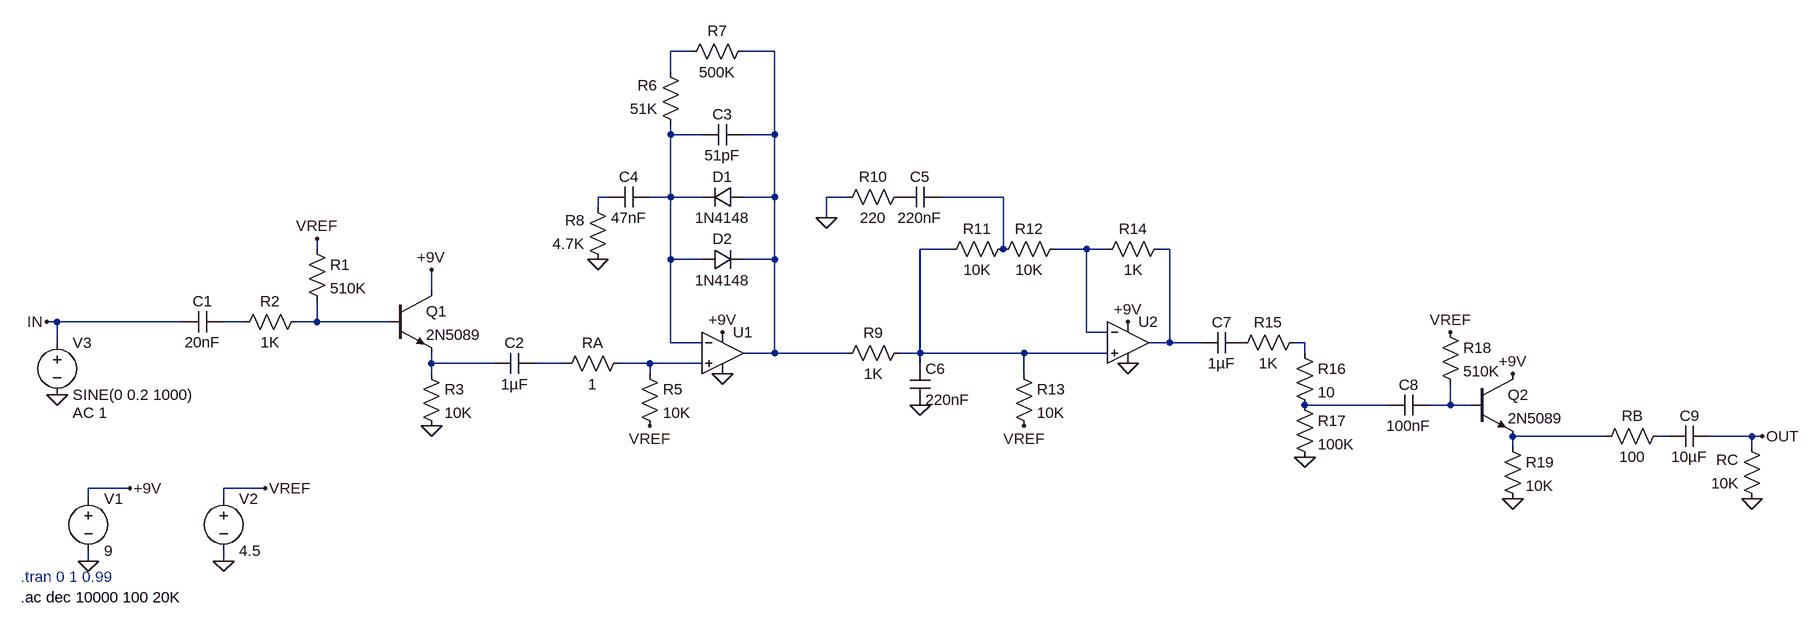
[diagram p0: schematic tubescreamer_sim.asc]
tubescreamer_sim.asc, the LTspice schematic file:
Version 4
SHEET 1 2276 680
WIRE 560 -272 528 -272
WIRE 688 -272 640 -272
WIRE 528 -240 528 -272
WIRE 528 -144 528 -160
WIRE 576 -144 528 -144
WIRE 688 -144 688 -272
WIRE 688 -144 640 -144
WIRE 432 -48 416 -48
WIRE 528 -48 528 -144
WIRE 528 -48 496 -48
WIRE 576 -48 528 -48
WIRE 688 -48 688 -144
WIRE 688 -48 640 -48
WIRE 800 -48 768 -48
WIRE 1040 -48 944 -48
WIRE 416 -32 416 -48
WIRE 768 -16 768 -48
WIRE -16 32 -16 16
WIRE 960 32 912 32
WIRE 1040 32 1040 -48
WIRE 1168 32 1120 32
WIRE 1200 32 1168 32
WIRE 1296 32 1280 32
WIRE 528 48 528 -48
WIRE 576 48 528 48
WIRE 688 48 688 -48
WIRE 688 48 640 48
WIRE 160 96 160 64
WIRE -416 144 -432 144
WIRE -224 144 -416 144
WIRE -128 144 -160 144
WIRE -16 144 -16 112
WIRE -16 144 -48 144
WIRE 96 144 -16 144
WIRE 1168 160 1168 32
WIRE 1200 160 1168 160
WIRE -416 176 -416 144
WIRE 528 176 528 48
WIRE 576 176 528 176
WIRE 1296 176 1296 32
WIRE 1296 176 1264 176
WIRE 1344 176 1296 176
WIRE 1504 176 1488 176
WIRE 688 192 688 48
WIRE 688 192 640 192
WIRE 800 192 688 192
WIRE 912 192 912 32
WIRE 912 192 880 192
WIRE 1072 192 912 192
WIRE 1200 192 1072 192
WIRE 1504 192 1504 176
WIRE 160 208 160 192
WIRE 256 208 160 208
WIRE 368 208 320 208
WIRE 496 208 448 208
WIRE 576 208 496 208
WIRE 912 208 912 192
WIRE 160 224 160 208
WIRE 496 224 496 208
WIRE 1072 224 1072 192
WIRE 1632 272 1504 272
WIRE 1728 272 1728 240
WIRE 1728 272 1696 272
WIRE 1760 272 1728 272
WIRE 1968 320 1824 320
WIRE 2064 320 2048 320
WIRE 2192 320 2128 320
WIRE 2208 320 2192 320
WIRE 1824 336 1824 320
WIRE 2192 336 2192 320
WIRE -304 400 -368 400
WIRE -96 400 -160 400
WIRE -368 416 -368 400
WIRE -160 416 -160 400
WIRE -368 512 -368 496
WIRE -160 512 -160 496
FLAG 160 304 0
FLAG -368 512 0
FLAG -304 400 +9V
FLAG -160 512 0
FLAG -96 400 VREF
FLAG 160 64 +9V
FLAG -16 16 VREF
FLAG 496 304 VREF
FLAG -416 256 0
FLAG -432 144 IN
FLAG 416 48 0
FLAG 608 160 +9V
FLAG 608 224 0
FLAG 768 -16 0
FLAG 912 272 0
FLAG 1072 304 VREF
FLAG 1232 144 +9V
FLAG 1232 208 0
FLAG 1504 352 0
FLAG 1728 160 VREF
FLAG 1824 416 0
FLAG 1824 224 +9V
FLAG 2192 416 0
FLAG 2208 320 OUT
SYMBOL npn 96 96 R0
SYMATTR InstName Q1
SYMATTR Value 2N5089
SYMBOL res -32 16 R0
SYMATTR InstName R1
SYMATTR Value 510K
SYMBOL res -32 128 R90
WINDOW 0 0 56 VBottom 2
WINDOW 3 32 56 VTop 2
SYMATTR InstName R2
SYMATTR Value 1K
SYMBOL res 144 208 R0
SYMATTR InstName R3
SYMATTR Value 10K
SYMBOL res 464 192 R90
WINDOW 0 0 56 VBottom 2
WINDOW 3 32 56 VTop 2
SYMATTR InstName RA
SYMATTR Value 1
SYMBOL res 480 208 R0
SYMATTR InstName R5
SYMATTR Value 10K
SYMBOL cap -160 128 R90
WINDOW 0 0 32 VBottom 2
WINDOW 3 32 32 VTop 2
SYMATTR InstName C1
SYMATTR Value 20nF
SYMBOL cap 320 192 R90
WINDOW 0 0 32 VBottom 2
WINDOW 3 32 32 VTop 2
SYMATTR InstName C2
SYMATTR Value 1µF
SYMBOL voltage -368 400 R0
WINDOW 123 0 0 Left 0
WINDOW 39 0 0 Left 0
SYMATTR InstName V1
SYMATTR Value 9
SYMBOL voltage -160 400 R0
WINDOW 123 0 0 Left 0
WINDOW 39 0 0 Left 0
SYMATTR InstName V2
SYMATTR Value 4.5
SYMBOL voltage -416 160 R0
WINDOW 123 24 124 Left 2
WINDOW 39 0 0 Left 0
SYMATTR Value2 AC 1
SYMATTR InstName V3
SYMATTR Value SINE(0 0.2 1000)
SYMBOL diode 640 -64 R90
WINDOW 0 0 32 VBottom 2
WINDOW 3 32 32 VTop 2
SYMATTR InstName D1
SYMATTR Value 1N4148
SYMBOL diode 576 64 R270
WINDOW 0 32 32 VTop 2
WINDOW 3 0 32 VBottom 2
SYMATTR InstName D2
SYMATTR Value 1N4148
SYMBOL cap 640 -160 R90
WINDOW 0 0 32 VBottom 2
WINDOW 3 32 32 VTop 2
SYMATTR InstName C3
SYMATTR Value 51pF
SYMBOL res 544 -144 R180
WINDOW 0 36 76 Left 2
WINDOW 3 36 40 Left 2
SYMATTR InstName R6
SYMATTR Value 51K
SYMBOL res 656 -288 R90
WINDOW 0 0 56 VBottom 2
WINDOW 3 32 56 VTop 2
SYMATTR InstName R7
SYMATTR Value 500K
SYMBOL cap 496 -64 R90
WINDOW 0 0 32 VBottom 2
WINDOW 3 32 32 VTop 2
SYMATTR InstName C4
SYMATTR Value 47nF
SYMBOL res 432 64 R180
WINDOW 0 36 76 Left 2
WINDOW 3 36 40 Left 2
SYMATTR InstName R8
SYMATTR Value 4.7K
SYMBOL res 896 176 R90
WINDOW 0 0 56 VBottom 2
WINDOW 3 32 56 VTop 2
SYMATTR InstName R9
SYMATTR Value 1K
SYMBOL res 896 -64 R90
WINDOW 0 0 56 VBottom 2
WINDOW 3 32 56 VTop 2
SYMATTR InstName R10
SYMATTR Value 220
SYMBOL cap 944 -64 R90
WINDOW 0 0 32 VBottom 2
WINDOW 3 32 32 VTop 2
SYMATTR InstName C5
SYMATTR Value 220nF
SYMBOL res 1056 16 R90
WINDOW 0 0 56 VBottom 2
WINDOW 3 32 56 VTop 2
SYMATTR InstName R11
SYMATTR Value 10K
SYMBOL res 1136 16 R90
WINDOW 0 0 56 VBottom 2
WINDOW 3 32 56 VTop 2
SYMATTR InstName R12
SYMATTR Value 10K
SYMBOL cap 896 208 R0
SYMATTR InstName C6
SYMATTR Value 220nF
SYMBOL res 1056 208 R0
SYMATTR InstName R13
SYMATTR Value 10K
SYMBOL res 1296 16 R90
WINDOW 0 0 56 VBottom 2
WINDOW 3 32 56 VTop 2
SYMATTR InstName R14
SYMATTR Value 1K
SYMBOL cap 1408 160 R90
WINDOW 0 0 32 VBottom 2
WINDOW 3 32 32 VTop 2
SYMATTR InstName C7
SYMATTR Value 1µF
SYMBOL res 1504 160 R90
WINDOW 0 0 56 VBottom 2
WINDOW 3 32 56 VTop 2
SYMATTR InstName R15
SYMATTR Value 1K
SYMBOL res 1488 176 R0
SYMATTR InstName R16
SYMATTR Value 10
SYMBOL res 1488 256 R0
SYMATTR InstName R17
SYMATTR Value 100K
SYMBOL cap 1696 256 R90
WINDOW 0 0 32 VBottom 2
WINDOW 3 32 32 VTop 2
SYMATTR InstName C8
SYMATTR Value 100nF
SYMBOL res 1712 144 R0
SYMATTR InstName R18
SYMATTR Value 510K
SYMBOL res 1808 320 R0
SYMATTR InstName R19
SYMATTR Value 10K
SYMBOL npn 1760 224 R0
SYMATTR InstName Q2
SYMATTR Value 2N5089
SYMBOL res 2064 304 R90
WINDOW 0 0 56 VBottom 2
WINDOW 3 32 56 VTop 2
SYMATTR InstName RB
SYMATTR Value 100
SYMBOL res 2208 432 R180
WINDOW 0 36 76 Left 2
WINDOW 3 36 40 Left 2
SYMATTR InstName RC
SYMATTR Value 10K
SYMBOL cap 2128 304 R90
WINDOW 0 0 32 VBottom 2
WINDOW 3 32 32 VTop 2
SYMATTR InstName C9
SYMATTR Value 10µF
SYMBOL UniversalOpAmp2 608 192 R0
SYMATTR InstName U1
SYMBOL UniversalOpAmp2 1232 176 R0
SYMATTR InstName U2
TEXT -472 536 Left 2 ;.tran 0 1 0.99
TEXT -472 568 Left 2 !.ac dec 10000 100 20K

The netlist it stands for:
* tubescreamer_sim.asc
Q1 +9V N010 N012 0 2N5089
R1 VREF N010 510K
R2 N010 N009 1K
R3 N012 0 10K
RA N014 N013 1
R5 N014 VREF 10K
C1 N009 IN 20nF
C2 N013 N012 1µF
V1 +9V 0 9
V2 VREF 0 4.5
V3 IN 0 SINE(0 0.2 1000) AC 1
D1 N002 N003 1N4148
D2 N003 N002 1N4148
C3 N002 N003 51pF
R6 N003 N001 51K
R7 N002 N001 500K
C4 N003 N004 47nF
R8 0 N004 4.7K
R9 N006 N002 1K
R10 P001 0 220
C5 N005 P001 220nF
R11 N005 N006 10K
R12 N007 N005 10K
C6 N006 0 220nF
R13 N006 VREF 10K
R14 N008 N007 1K
C7 P002 N008 1µF
R15 N011 P002 1K
R16 N011 N015 10
R17 N015 0 100K
C8 N016 N015 100nF
R18 VREF N016 510K
R19 N017 0 10K
Q2 +9V N016 N017 0 2N5089
RB N018 N017 100
RC 0 OUT 10K
C9 OUT N018 10µF
XU1 N014 N003 +9V 0 N002 level2 Avol=1Meg GBW=10Meg Slew=10Meg Ilimit=25m Rail=0 Vos=0 En=0 Enk=0 In=0 Ink=0 Rin=500Meg  ; pins In+ In- V+ V- OUT
XU2 N006 N007 +9V 0 N008 level2 Avol=1Meg GBW=10Meg Slew=10Meg Ilimit=25m Rail=0 Vos=0 En=0 Enk=0 In=0 Ink=0 Rin=500Meg  ; pins In+ In- V+ V- OUT
.model D D
.lib standard.dio
.model NPN NPN
.model PNP PNP
.lib standard.bjt
* .tran 0 1 0.99
.ac dec 10000 100 20K
.lib UniversalOpAmp2.lib
.backanno
.end